# EAGLE design schemat (EAGLE 8.1.1)
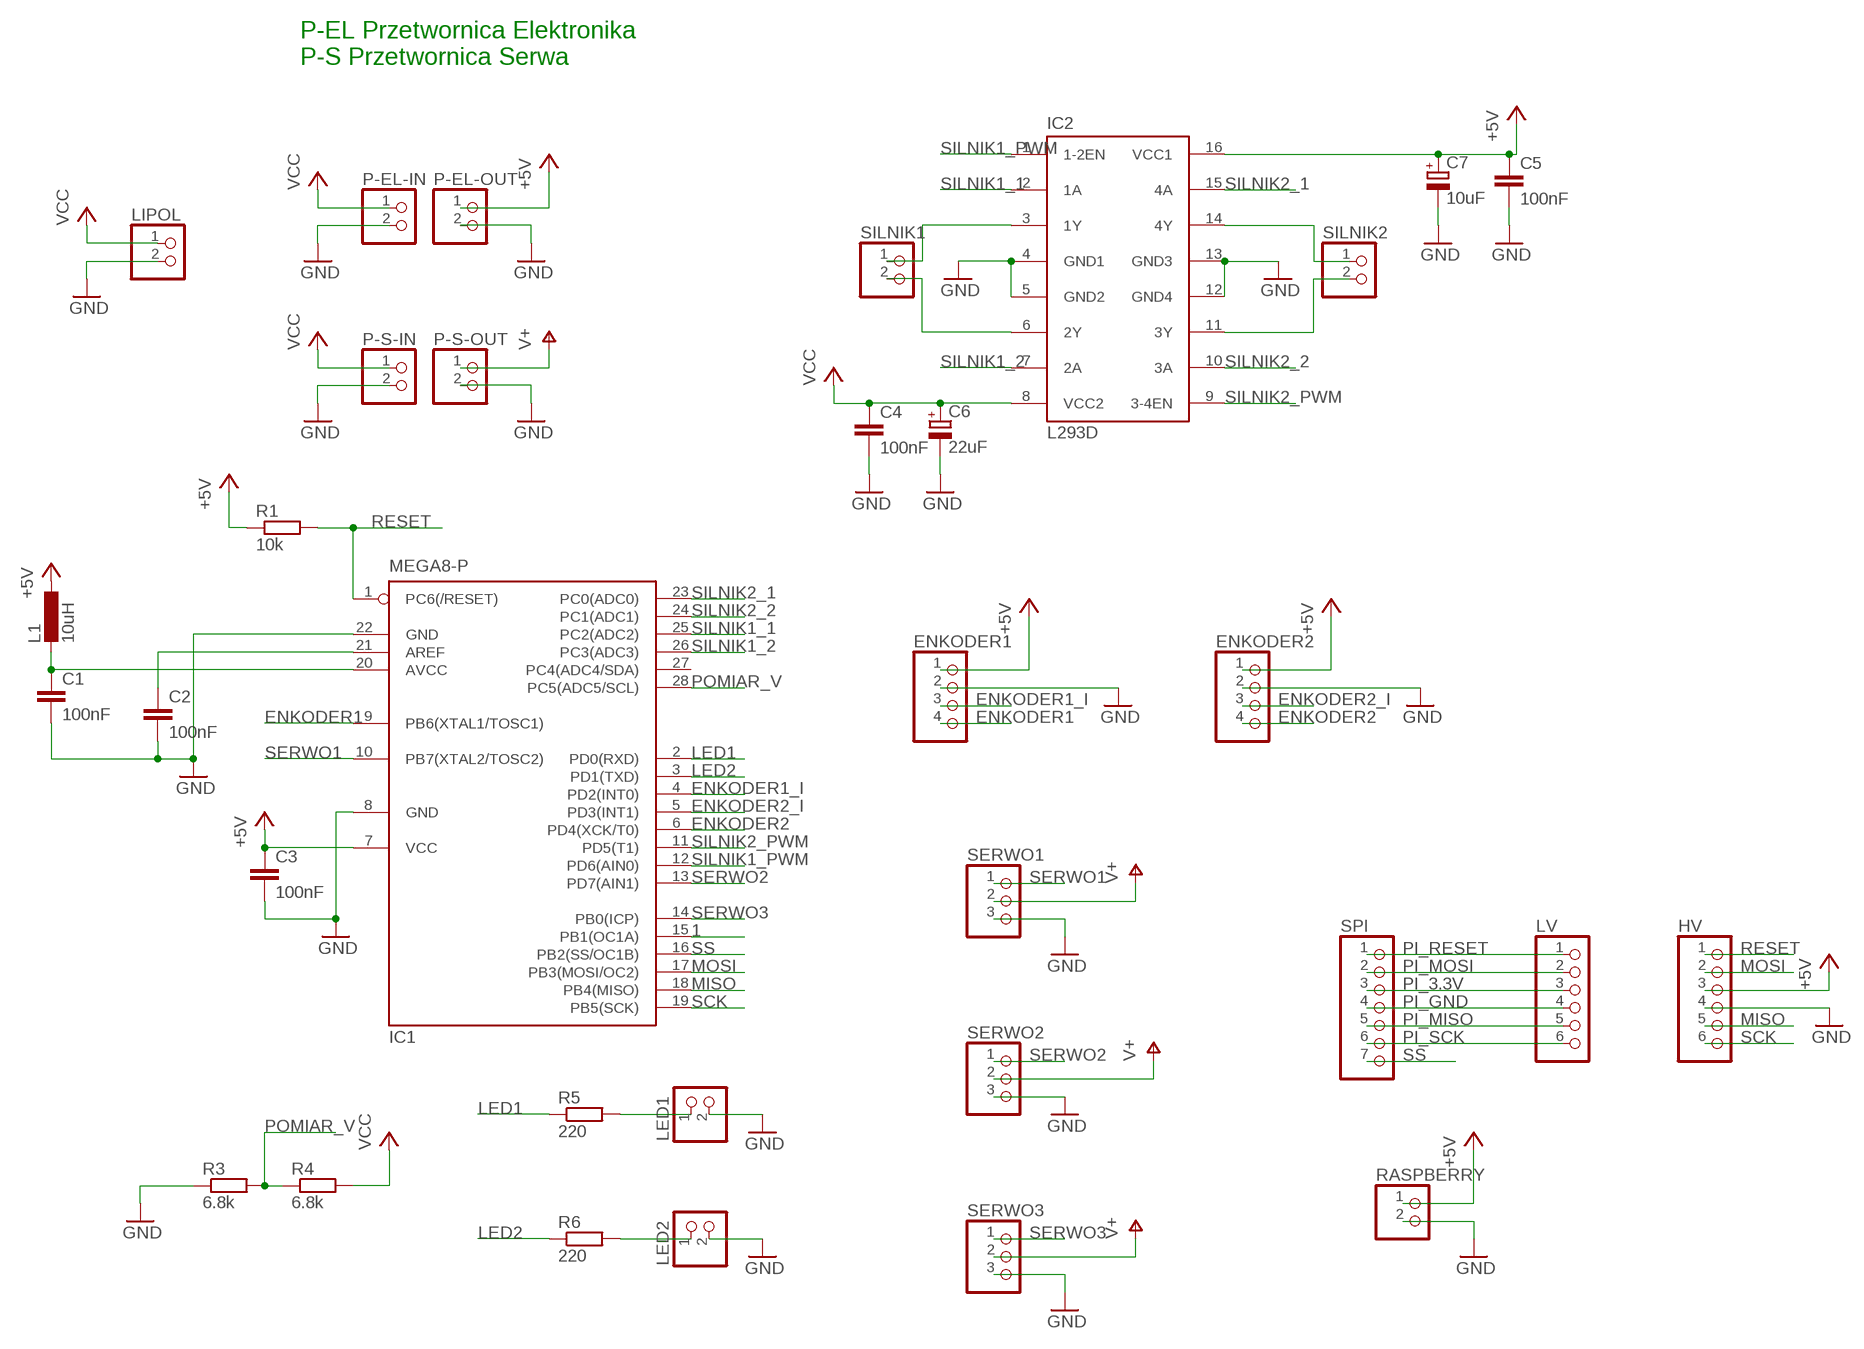
[diagram p0: schematic, sheet 1]

## Parts
C1  100nF  C-EU050-030X075  [C050-030X075]
C2  100nF  C-EU025-030X050  [C025-030X050]
C3  100nF  C-EU025-030X050  [C025-030X050]
C4  100nF  C-EU025-030X050  [C025-030X050]
C5  100nF  C-EU025-030X050  [C025-030X050]
C6  22uF  CPOL-EUE2.5-5  [E2,5-5]
C7  10uF  CPOL-EUE2.5-5  [E2,5-5]
ENKODER1  PINHD-1X4  [1X04]
ENKODER2  PINHD-1X4  [1X04]
HV  PINHD-1X6  [1X06]
IC1  MEGA8-P  [DIL28-3]
IC2  L293D  [DIL16]
L1  10uH  L-EU0204/7  [0204/7]
LED1  PINHD-1X2  [1X02]
LED2  PINHD-1X2  [1X02]
LIPOL  PINHD-1X2  [1X02]
LV  PINHD-1X6  [1X06]
P-EL-IN  PINHD-1X2  [1X02]
P-EL-OUT  PINHD-1X2  [1X02]
P-S-IN  PINHD-1X2  [1X02]
P-S-OUT  PINHD-1X2  [1X02]
R1  10k  R-EU_0204/7  [0204/7]
R3  6.8k  R-EU_0204/7  [0204/7]
R4  6.8k  R-EU_0204/7  [0204/7]
R5  220  R-EU_0204/7  [0204/7]
R6  220  R-EU_0204/7  [0204/7]
RASPBERRY  PINHD-1X2  [1X02]
SERWO1  PINHD-1X3  [1X03]
SERWO2  PINHD-1X3  [1X03]
SERWO3  PINHD-1X3  [1X03]
SILNIK1  PINHD-1X2  [1X02]
SILNIK2  PINHD-1X2  [1X02]
SPI  PINHD-1X7  [1X07]

## Nets
1: IC1.15(PB1(OC1A))
+5V: C3.1 C5.1 C7.+ ENKODER1.1 ENKODER2.1 HV.3 IC1.7(VCC) IC2.16(VCC1) L1.1 P-EL-OUT.1 R1.1 RASPBERRY.1
ENKODER1: ENKODER1.4 IC1.9(PB6(XTAL1/TOSC1))
ENKODER1_I: ENKODER1.3 IC1.4(PD2(INT0))
ENKODER2: ENKODER2.4 IC1.6(PD4(XCK/T0))
ENKODER2_I: ENKODER2.3 IC1.5(PD3(INT1))
GND: C1.2 C2.2 C3.2 C4.2 C5.2 C6.- C7.- ENKODER1.2 ENKODER2.2 HV.4 IC1.8(GND) IC1.22(GND) IC2.4(GND1) IC2.5(GND2) IC2.12(GND4) IC2.13(GND3) LED1.2 LED2.2 LIPOL.2 P-EL-IN.2 P-EL-OUT.2 P-S-IN.2 P-S-OUT.2 R3.1 RASPBERRY.2 SERWO1.3 SERWO2.3 SERWO3.3
LED1: IC1.2(PD0(RXD)) R5.1
LED2: IC1.3(PD1(TXD)) R6.1
MISO: HV.5 IC1.18(PB4(MISO))
MOSI: HV.2 IC1.17(PB3(MOSI/OC2))
N$1: IC2.14(4Y) SILNIK2.1
N$2: C2.1 IC1.21(AREF)
N$3: C1.1 IC1.20(AVCC) L1.2
N$4: IC2.11(3Y) SILNIK2.2
N$7: IC2.3(1Y) SILNIK1.1
N$8: LED1.1 R5.2
N$9: LED2.1 R6.2
N$10: IC2.6(2Y) SILNIK1.2
PI_3.3V: LV.3 SPI.3
PI_GND: LV.4 SPI.4
PI_MISO: LV.5 SPI.5
PI_MOSI: LV.2 SPI.2
PI_RESET: LV.1 SPI.1
PI_SCK: LV.6 SPI.6
POMIAR_V: IC1.28(PC5(ADC5/SCL)) R3.2 R4.1
RESET: HV.1 IC1.1(PC6(/RESET)) R1.2
SCK: HV.6 IC1.19(PB5(SCK))
SERWO1: IC1.10(PB7(XTAL2/TOSC2)) SERWO1.1
SERWO2: IC1.13(PD7(AIN1)) SERWO2.1
SERWO3: IC1.14(PB0(ICP)) SERWO3.1
SILNIK1_1: IC1.25(PC2(ADC2)) IC2.2(1A)
SILNIK1_2: IC1.26(PC3(ADC3)) IC2.7(2A)
SILNIK1_PWM: IC1.12(PD6(AIN0)) IC2.1(1-2EN)
SILNIK2_1: IC1.23(PC0(ADC0)) IC2.15(4A)
SILNIK2_2: IC1.24(PC1(ADC1)) IC2.10(3A)
SILNIK2_PWM: IC1.11(PD5(T1)) IC2.9(3-4EN)
SS: IC1.16(PB2(SS/OC1B)) SPI.7
V+: P-S-OUT.1 SERWO1.2 SERWO2.2 SERWO3.2
VCC: C4.1 C6.+ IC2.8(VCC2) LIPOL.1 P-EL-IN.1 P-S-IN.1 R4.2
Unconnected: IC1.27(PC4(ADC4/SDA))

## Notes on the sheet
- P-EL Przetwornica Elektronika
  P-S Przetwornica Serwa

## Library data of the parts
C1-C5 = rcl:C-EU: CAPACITOR, European symbol
C6 C7 = rcl:CPOL-EU: POLARIZED CAPACITOR, European symbol
ENKODER1 ENKODER2 = pinhead:PINHD-1X4: PIN HEADER
HV LV = pinhead:PINHD-1X6: PIN HEADER
IC1 = atmel:MEGA8-P: MICROCONTROLLER 8 Kbytes FLASH, 1 kbytes SRAM, 512 bytes EEPROM, USART, 4-channel 10 bit ADC, 2-channel 8 bit ADC Pin compatible with Atmega48, ATMega88, ATMega168 Source: avr.lbr; OC_FARNELL: unknown; OC_NEWARK: unknown
IC2 = st-microelectronics:L293D: PUSH-PULL 4 CHANNEL DRIVER; MPN: L293D; OC_FARNELL: 9589619; OC_NEWARK: 56P8249
L1 = rcl:L-EU: INDUCTOR, European symbol
LED1 LED2 LIPOL P-EL-IN P-EL-OUT P-S-IN P-S-OUT RASPBERRY SILNIK1 SILNIK2 = pinhead:PINHD-1X2: PIN HEADER
R1 R3-R6 = rcl:R-EU_: RESISTOR, European symbol
SERWO1-SERWO3 = pinhead:PINHD-1X3: PIN HEADER
SPI = pinhead:PINHD-1X7: PIN HEADER

## Board
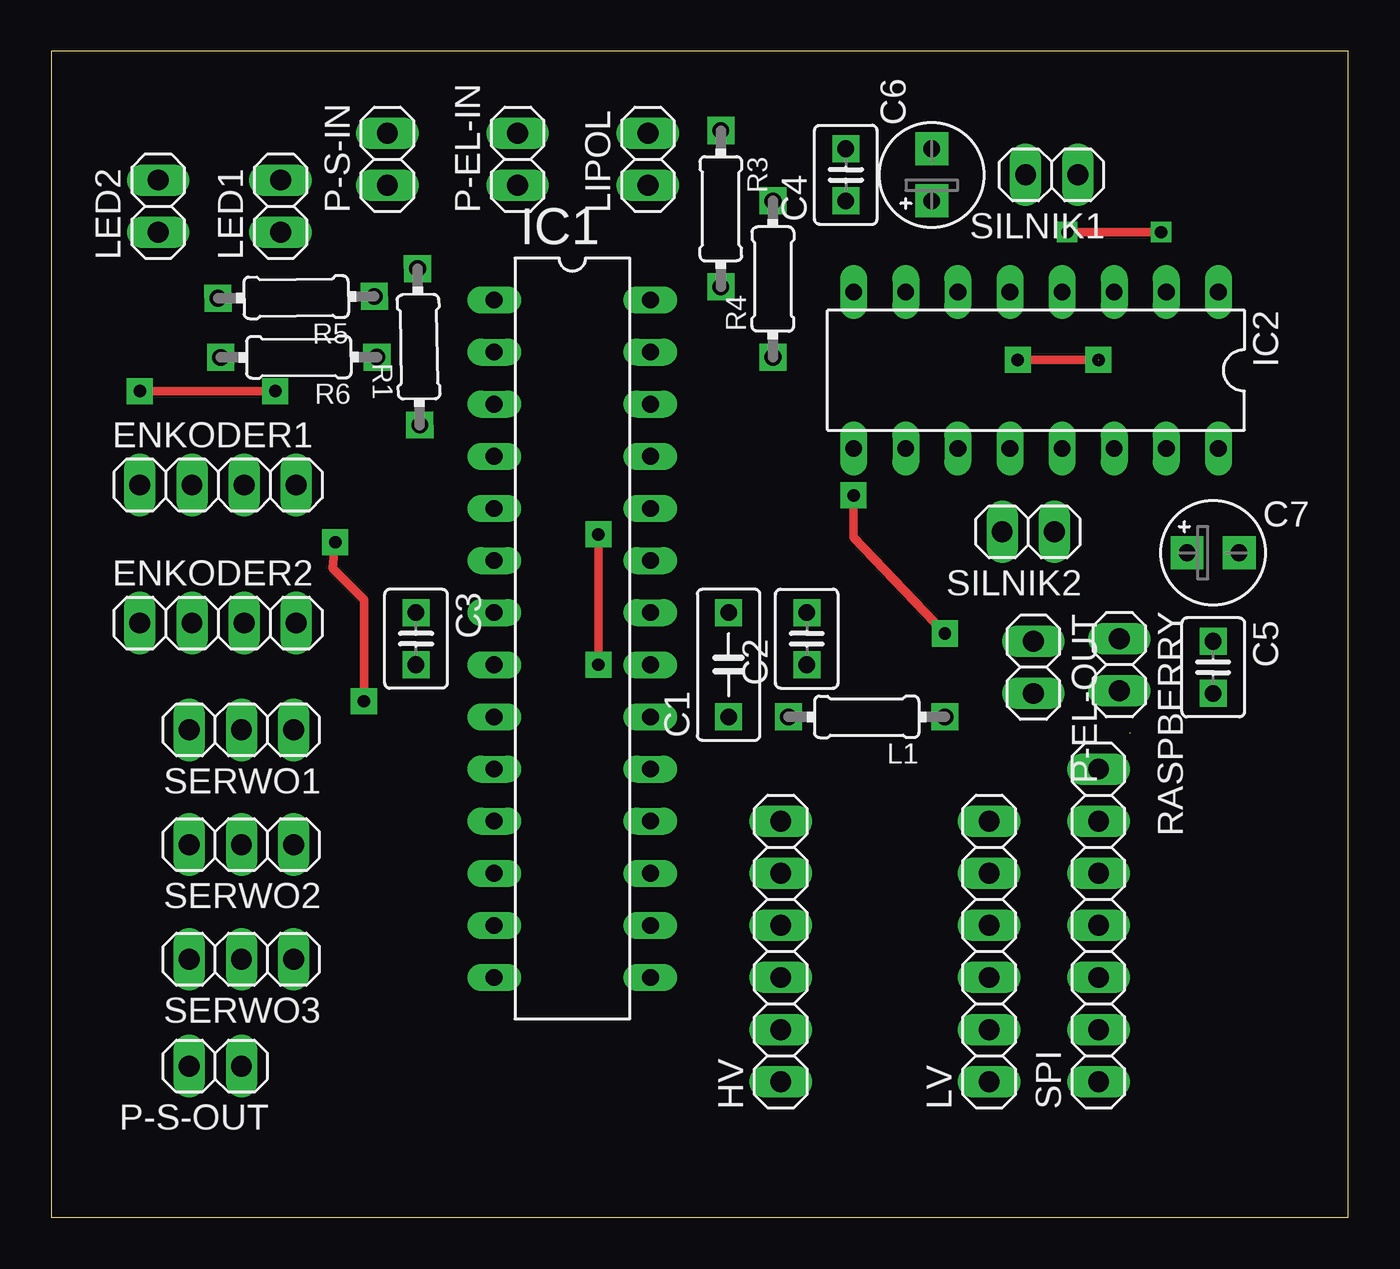
[diagram p1: board, top side]
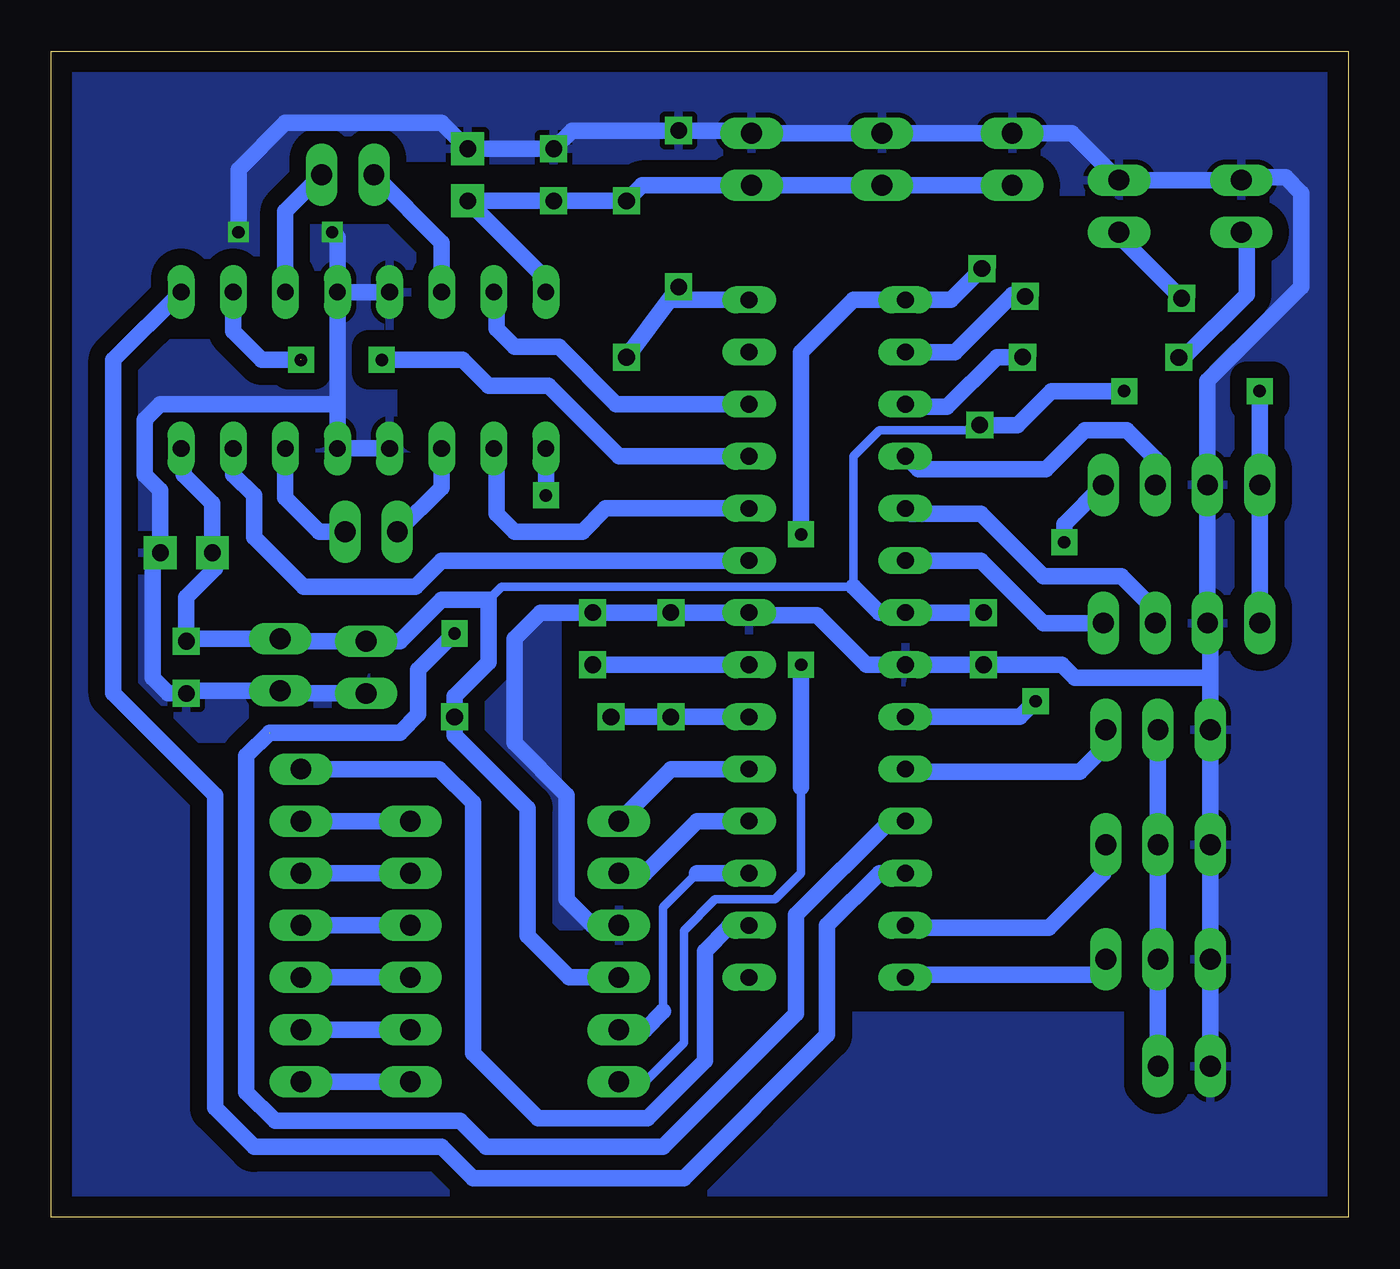
[diagram p2: board, bottom side, seen from below]

Size 63.23 x 56.82 mm. Coordinates in mm from the lower left corner, seen from the top.
Outline: 0,0 63.23,0 63.23,56.82 0,56.82 0,0
Copper layers (1*16): Top 0.035mm / dielectric 1.5mm / Bottom 0.035mm
Design rules "default": minimum track width 10mil, minimum drill 24mil, track to track 8mil, track to pad 8mil, pad to pad 8mil, via to via 8mil, smd to smd 8mil, copper to edge 40mil, drill to drill 8mil, minimum pad ring 10mil, minimum via ring 8mil, stop-mask expansion 4mil, vias tented up to drill 0mil, thermal gap 10mil
bRestrict: area 7.6,30.9 to 9.9,33.9; area 7.6,8.8 to 8,11; area 7.6,14.1 to 8,16.8; area 7.6,19.8 to 8.4,22.1; area 9.9,7.6 to 24.4,11.4; area 6.9,48.4 to 9.5,49.9; area 17.9,51.8 to 21.3,51.8; area 24.4,51.8 to 27.4,51.8; area 9.9,6.5 to 9.9,7.6; area 7.6,25.1 to 14.1,27.4; area 15.2,27.8 to 20.2,27.8; area 16.8,25.9 to 20.6,25.9; 26 more areas

### Footprints (pad centres in the part's own frame; a part is rotated, then mirrored left to right if it is on the bottom)
C050-030X075 = drill 0.813 square: 1 -2.54,0; 2 2.54,0
C025-030X050 = drill 0.813 square: 1 -1.27,0; 2 1.27,0
E2,5-5 = drill 0.813 pad 1.6 square: + -1.27,0; - 1.27,0
1X04 = drill 1.016 long: 1 -3.81,0; 2 -1.27,0; 3 1.27,0; 4 3.81,0
1X06 = drill 1.016 long: 1 -6.35,0; 2 -3.81,0; 3 -1.27,0; 4 1.27,0; 5 3.81,0; 6 6.35,0
DIL28-3 = drill 0.813 long: 1 -16.51,-3.81; 2 -13.97,-3.81; 3 -11.43,-3.81; 4 -8.89,-3.81; 5 -6.35,-3.81; 6 -3.81,-3.81; 7 -1.27,-3.81; 8 1.27,-3.81; 9 3.81,-3.81; 10 6.35,-3.81; 11 8.89,-3.81; 12 11.43,-3.81; 13 13.97,-3.81; 14 16.51,-3.81; 15 16.51,3.81; 16 13.97,3.81; 17 11.43,3.81; 18 8.89,3.81; 19 6.35,3.81; 20 3.81,3.81; 21 1.27,3.81; 22 -1.27,3.81; 23 -3.81,3.81; 24 -6.35,3.81; 25 -8.89,3.81; 26 -11.43,3.81; 27 -13.97,3.81; 28 -16.51,3.81
DIL16 = drill 0.813 long: 1 -8.89,-3.81; 2 -6.35,-3.81; 3 -3.81,-3.81; 4 -1.27,-3.81; 5 1.27,-3.81; 6 3.81,-3.81; 7 6.35,-3.81; 8 8.89,-3.81; 9 8.89,3.81; 10 6.35,3.81; 11 3.81,3.81; 12 1.27,3.81; 13 -1.27,3.81; 14 -3.81,3.81; 15 -6.35,3.81; 16 -8.89,3.81
0204/7 = drill 0.813 square: 1 -3.81,0; 2 3.81,0
1X02 = drill 1.016 long: 1 -1.27,0; 2 1.27,0
1X03 = drill 1.016 long: 1 -2.54,0; 2 0,0; 3 2.54,0
1X07 = drill 1.016 long: 1 -7.62,0; 2 -5.08,0; 3 -2.54,0; 4 0,0; 5 2.54,0; 6 5.08,0; 7 7.62,0

### Placement (x,y rotation side)
C1  33.02,26.92 90 top
C2  36.83,28.19 90 top
C3  17.78,28.19 270 top
C4  38.73,50.8 90 top
C5  56.64,26.8 270 top
C6  42.93,50.8 90 top
C7  56.64,32.39 0 top
ENKODER1  8.13,35.69 0 top
ENKODER2  8.13,28.96 0 top
HV  35.56,12.95 90 top
IC1  25.4,28.19 270 top
IC2  48.01,41.27 180 top
L1  39.75,24.38 180 top
LED1  11.18,49.28 90 top
LED2  5.21,49.28 90 top
LIPOL  29.08,51.56 90 top
LV  45.72,12.95 90 top
P-EL-IN  22.73,51.56 90 top
P-EL-OUT  47.88,26.8 270 top
P-S-IN  16.38,51.56 90 top
P-S-OUT  8,7.37 180 top
R1  17.91,42.42 90.8 top
R3  32.64,49.15 270 top
R4  35.18,45.72 90 top
R5  11.94,44.83 180.7 top
R6  12.07,41.91 180.1 top
RASPBERRY  52.07,26.92 270 top
SERWO1  9.27,23.75 180 top
SERWO2  9.27,18.16 180 top
SERWO3  9.27,12.57 180 top
SILNIK1  48.77,50.8 180 top
SILNIK2  47.62,33.4 180 top
SPI  51.05,14.22 90 top

### Tracks (layer width: path | path; a pad name or v marks a point on that pad's centre or on a via)
+5V  (via drill 0.6 pad 1.27)
  Top 0.406: v4.32,40.26 v10.92,40.26
  Bottom 0.406: 41.91,30.1 41.27,30.73 24.13,30.73 24.13,37.08 22.86,38.35 18.21,38.35 R1.1 17.83,38.48 | 51.94,28.07 RASPBERRY.1 | 56.52,28.19 C5.1
  Bottom 0.813: C3.1 IC1.7 22.86,29.46 24.13,30.73 | ENKODER2.1 ENKODER1.1 v4.32,40.26 | HV.3 37.97,11.68 40,13.72 40,19.94 43.56,23.5 L1.1 43.56,25.4 41.91,27.05 41.91,30.1 44.2,30.1 46.23,28.07 P-EL-OUT.1 51.94,28.07 | RASPBERRY.1 56.52,28.19 | C5.1 56.64,30.23 55.24,31.62 55.24,32.26 C7.+ 55.37,34.8 56.77,36.19 56.77,37.34 IC2.16 | v10.92,40.26 14.48,40.26 16.13,38.61 R1.1 | R1.1
ENKODER1  (via drill 0.6 pad 1.27)
  Top 0.406: v15.24,25.15 15.24,30.1 13.72,31.62 v13.84,32.89
  Bottom 0.813: v15.24,25.15 16,24.38 IC1.9 | v13.84,32.89 13.84,33.78 ENKODER1.4
ENKODER1_I
  Bottom 0.813: ENKODER1.3 9.4,36.96 10.79,38.35 12.83,38.35 14.73,36.45 20.96,36.45 IC1.4
ENKODER2
  Bottom 0.813: ENKODER2.4 14.86,28.96 17.91,32 IC1.6
ENKODER2_I
  Bottom 0.813: IC1.5 21.34,34.29 17.91,34.29 14.86,31.24 11.05,31.24 9.4,29.59 ENKODER2.3
GND  (via drill 0.6)
  Top 0.406: v49.53,48.01 v54.1,48.01
  Bottom 0.406: 29.21,52.96 LIPOL.2 | 51.94,25.53 RASPBERRY.2 | 56.52,25.65 C5.2 | 5.08,50.67 LED2.2 | 6.73,26.29
  Bottom 0.813: HV.4 36.83,14.22 38.1,15.49 38.1,20.57 40.64,23.11 40.64,28.19 39.37,29.46 C2.2 C1.2 IC1.22 29.08,29.34 25.91,29.34 23.5,26.92 IC1.8 C3.2 13.97,26.92 13.34,26.29 6.73,26.29 | LIPOL.2 P-EL-IN.2 P-S-IN.2 13.46,52.83 LED1.2 LED2.2 | IC2.12 IC2.13 49.28,39.62 | 49.28,39.62 IC2.4 | IC2.4 IC2.5 | 49.28,39.62 57.91,39.62 58.67,38.86 58.67,36.19 57.91,35.43 C7.- 58.29,32 58.29,26.29 57.53,25.53 C5.2 | 29.21,52.96 R3.1 37.85,52.96 C4.2 C6.- 44.2,53.34 51.82,53.34 54.1,51.05 v54.1,48.01 | P-EL-OUT.2 51.94,25.53 | RASPBERRY.2 56.52,25.65 | P-S-OUT.2 SERWO3.3 SERWO2.3 SERWO1.3 6.73,26.29 6.73,28.83 ENKODER2.2 ENKODER1.2 6.86,40.77 2.29,45.34 2.29,49.91 3.05,50.67 5.08,50.67 | IC2.4 49.28,47.75 v49.53,48.01
  pour Bottom (isolate 0.813): 0,56.77 63.25,56.77 63.25,0 0,0
LED1
  Bottom 0.406: 16.38,44.96 15.83,44.96
  Bottom 0.813: IC1.2 19.18,42.16 16.38,44.96 | 15.83,44.96 R5.1
LED2
  Bottom 0.406: 15.88,41.91 R6.1
  Bottom 0.813: R6.1 17.14,41.92 19.56,39.5 21.46,39.5 IC1.3
MISO
  Bottom 0.813: HV.5 34.29,16.76 31.75,19.3 IC1.18
MOSI
  Bottom 0.406: 33.4,10.03 33.4,15.11 31.75,16.76
  Bottom 0.813: HV.2 34.29,9.14 33.4,10.03 | 31.75,16.76 IC1.17
N$1
  Bottom 0.813: SILNIK2.1 50.16,33.4 51.82,35.05 IC2.14
N$2
  Bottom 0.813: IC1.21 C2.1
N$3
  Bottom 0.813: IC1.20 C1.1 L1.2
N$4
  Bottom 0.813: IC2.11 44.2,35.56 SILNIK2.2
N$7
  Bottom 0.813: IC2.3 51.82,49.02 SILNIK1.1
N$8
  Bottom 0.406: LED1.1 11.18,47.83
  Bottom 0.813: 11.18,47.83 R5.2
N$9
  Bottom 0.406: R6.2 8.01,41.9
  Bottom 0.813: 8.01,41.9 4.95,44.96 4.95,47.75 LED2.1
N$10
  Bottom 0.813: IC2.6 44.2,47.5 SILNIK1.2
PI_3.3V
  Bottom 0.813: SPI.3 LV.3
PI_GND
  Bottom 0.813: SPI.4 LV.4
PI_MISO
  Bottom 0.813: SPI.5 LV.5
PI_MOSI
  Bottom 0.813: SPI.2 LV.2
PI_RESET
  Bottom 0.813: SPI.1 LV.1
PI_SCK
  Bottom 0.813: SPI.6 LV.6
POMIAR_V
  Bottom 0.406: R3.2 33.05,44.79 32.97,44.7
  Bottom 0.813: 33.05,44.79 R4.1 | IC1.28 32.97,44.7
RESET  (via drill 0.6 pad 1.27)
  Top 0.406: v26.67,33.27 v26.67,26.92
  Bottom 0.406: HV.1 34.29,6.6 32.39,8.51 32.39,13.97 30.86,15.49 27.94,15.49 26.67,16.76 26.67,20.96
  Bottom 0.813: v26.67,33.27 26.67,42.16 24.13,44.7 IC1.1 19.38,44.7 R1.2 | v26.67,26.92 26.67,20.96
SCK
  Bottom 0.813: HV.6 33.02,21.84 IC1.19
SERWO1
  Bottom 0.813: IC1.10 21.46,21.72 13.08,21.72 11.81,22.99 SERWO1.1
SERWO2
  Bottom 0.406: IC1.13 21.46,14.1
  Bottom 0.813: SERWO2.1 11.94,18.03 11.94,16.76 14.61,14.1 21.46,14.1
SERWO3
  Bottom 0.813: IC1.14 21.46,11.81 11.81,11.81 SERWO3.1
SILNIK1_1  (via drill 0.6 pad 1.27)  (1 unrouted)
  Top 0.406: v51.05,41.78 v47.12,41.78
  Bottom 0.813: IC2.2 54.36,43.18 52.96,41.78 51.08,41.78 | IC1.25 35.56,37.08 38.99,40.51 41.91,40.51 43.18,41.78 v47.12,41.78
SILNIK1_2
  Bottom 0.813: IC1.26 35.69,39.62 38.48,42.42 40.64,42.42 41.53,43.31 41.53,44.96 IC2.7
SILNIK1_PWM
  Bottom 0.813: IC1.12 22.86,16.76 25.4,14.22 25.4,8.89 32.39,1.91 42.67,1.91 44.2,3.43 53.34,3.43 55.24,5.33 55.24,20.57 60.2,25.53 60.2,41.78 IC2.1
SILNIK2_1
  Bottom 0.813: IC1.23 44.2,32 45.47,30.73 50.93,30.73 53.34,33.15 53.34,35.18 54.36,36.19 IC2.15
SILNIK2_2
  Bottom 0.813: IC1.24 36.19,34.54 37.34,33.4 40.64,33.4 41.53,34.29 41.53,37.34 IC2.10
SILNIK2_PWM  (via drill 0.6 pad 1.27)  (1 unrouted)
  Top 0.406: v39.12,35.18 39.12,33.15 v43.56,28.45
  Bottom 0.406: 52.38,23.62 52.41,23.6 52.58,23.6
  Bottom 0.813: v39.12,35.18 IC2.9 | IC1.11 22.35,19.3 26.92,14.73 26.92,9.91 33.4,3.43 42.04,3.43 43.31,4.7 52.32,4.7 53.72,6.1 53.72,22.48 52.58,23.62 46.23,23.62 45.34,24.51 45.34,26.67 v43.56,28.45
SS
  Bottom 0.813: SPI.7 44.32,21.84 42.67,20.19 42.67,8.38 42.67,8 39.5,4.83 34.16,4.83 31.37,7.62 31.37,12.95 30.23,14.1 29.34,14.1 IC1.16
V+
  Bottom 0.813: SERWO1.2 SERWO2.2 SERWO3.2 P-S-OUT.1
VCC
  Bottom 0.813: P-S-IN.1 P-EL-IN.1 LIPOL.1 34.42,50.29 R4.2 C4.1 C6.+ 39.12,45.72 IC2.8